# Altium schematic sheet Block_Diagram.SchDoc: Block Diagram
size A4; DrawnBy: Siddhant Jajoo; Organization: Team - Ashwathama; Address1: Colorado Boulder; Address2: Author : Siddhant Jajoo; Address3: Self Checkout Shopping Cart; DocumentNumber: 1; Revision: 1.0; SheetNumber: 0; SheetTotal: 7; DocumentName: Block Diagram; ProjectName: Self Checkout Shopping Cart
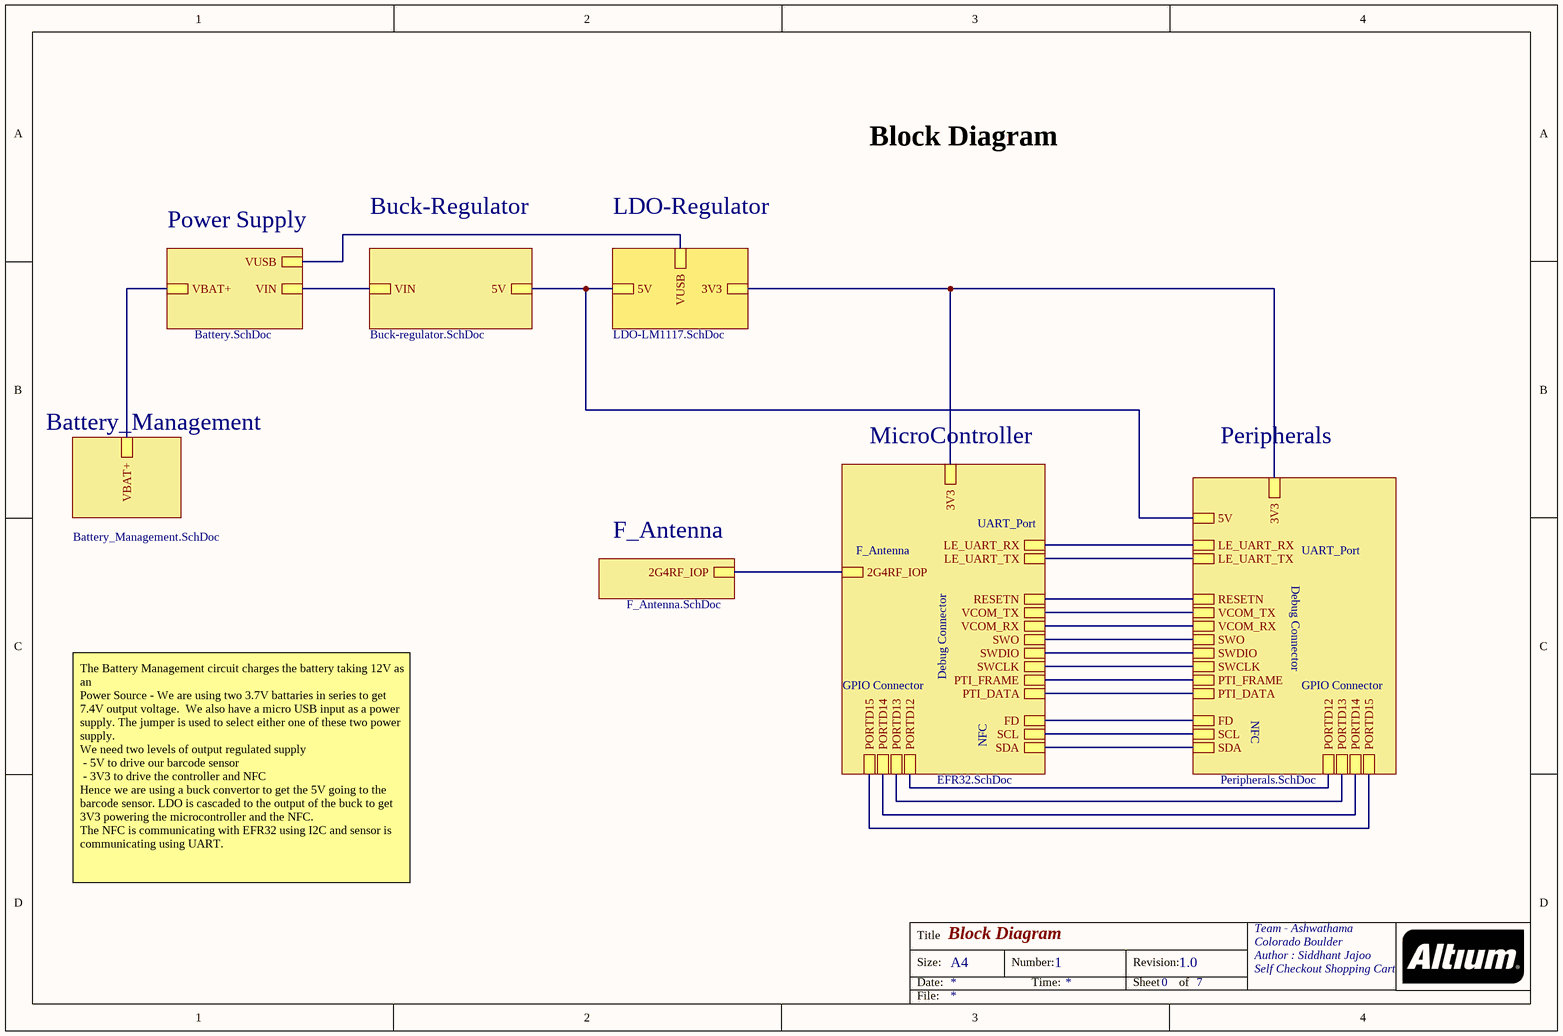
[diagram p0: Block_Diagram.SchDoc]

## Sub-sheets
Battery_Management = Battery_Management.SchDoc: VBAT+
Buck-Regulator = Buck-regulator.SchDoc: VIN, 5V
F_Antenna = F_Antenna.SchDoc: 2G4RF_IOP
LDO-Regulator = LDO-LM1117.SchDoc: 3V3, 5V, VUSB
MicroController = EFR32.SchDoc: LE_UART_RX, LE_UART_TX, 2G4RF_IOP, SCL, SDA, 3V3, FD, RESETN, VCOM_TX, VCOM_RX, PTI_FRAME, PTI_DATA, SWO, SWDIO, SWCLK, PORTD12, PORTD13, PORTD14, PORTD15
Peripherals = Peripherals.SchDoc: PTI_FRAME, SWDIO, VCOM_TX, RESETN, FD, VCOM_RX, SWO, SWCLK, PTI_DATA, SCL, SDA, 3V3, LE_UART_RX, LE_UART_TX, 5V, PORTD12, PORTD13, PORTD14, PORTD15
Power Supply = Battery.SchDoc: VBAT+, VIN, VUSB

## Nets
(unnamed): sheet Buck-Regulator/VIN, sheet Power Supply/VIN
(unnamed): sheet Buck-Regulator/5V, sheet LDO-Regulator/5V, sheet Peripherals/5V
(unnamed): sheet LDO-Regulator/3V3, sheet Peripherals/3V3, sheet MicroController/3V3
(unnamed): sheet LDO-Regulator/VUSB, sheet Power Supply/VUSB
(unnamed): sheet F_Antenna/2G4RF_IOP, sheet MicroController/2G4RF_IOP
(unnamed): sheet Peripherals/PTI_FRAME, sheet MicroController/PTI_FRAME
(unnamed): sheet Peripherals/SWDIO, sheet MicroController/SWDIO
(unnamed): sheet Peripherals/VCOM_TX, sheet MicroController/VCOM_TX
(unnamed): sheet Peripherals/RESETN, sheet MicroController/RESETN
(unnamed): sheet Peripherals/FD, sheet MicroController/FD
(unnamed): sheet Peripherals/VCOM_RX, sheet MicroController/VCOM_RX
(unnamed): sheet Peripherals/SWO, sheet MicroController/SWO
(unnamed): sheet Peripherals/SWCLK, sheet MicroController/SWCLK
(unnamed): sheet Peripherals/PTI_DATA, sheet MicroController/PTI_DATA
(unnamed): sheet Peripherals/SCL, sheet MicroController/SCL
(unnamed): sheet Peripherals/SDA, sheet MicroController/SDA
(unnamed): sheet Peripherals/LE_UART_RX, sheet MicroController/LE_UART_RX
(unnamed): sheet Peripherals/LE_UART_TX, sheet MicroController/LE_UART_TX
(unnamed): sheet Peripherals/PORTD12, sheet MicroController/PORTD12
(unnamed): sheet Peripherals/PORTD13, sheet MicroController/PORTD13
(unnamed): sheet Peripherals/PORTD14, sheet MicroController/PORTD14
(unnamed): sheet Peripherals/PORTD15, sheet MicroController/PORTD15
(unnamed): sheet Power Supply/VBAT+, sheet Battery_Management/VBAT+

## Notes on the sheet
- Block Diagram
- F_Antenna
- UART_Port
- Debug Connector
- GPIO Connector
- NFC
- The Battery Management circuit charges the battery taking 12V as an
  Power Source - We are using two 3.7V battaries in series to get 7.4V output voltage.  We also have a micro USB input as a power supply. The jumper is used to select either one of these two power supply.
  We need two levels of output regulated supply
  - 5V to drive our barcode sensor
  - 3V3 to drive the controller and NFC
  Hence we are using a buck convertor to get the 5V going to the barcode sensor. LDO is cascaded to the output of the buck to get 3V3 powering the microcontroller and the NFC.
  The NFC is communicating with EFR32 using I2C and sensor is communicating using UART.
- Title
- Size:
- Date:
- A4
- Number:
- Time:
- Revision:
- Sheet
- of
- File: